# EAGLE design Taiwan_Arduino (EAGLE 7.2.0)
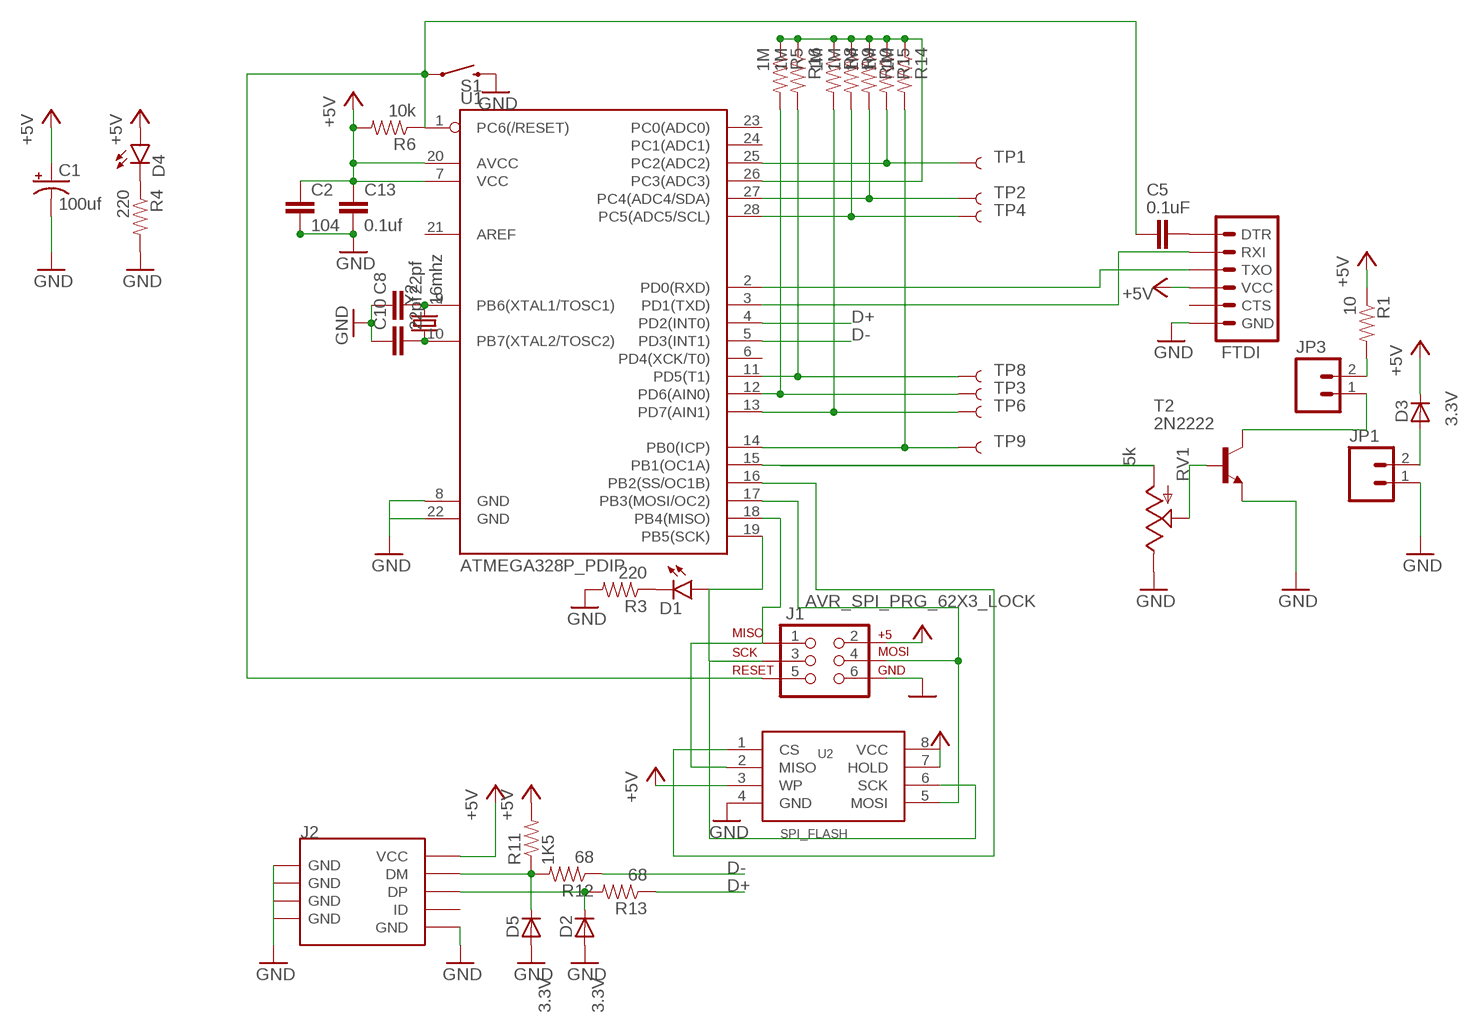
[diagram p0: schematic, sheet 1]

## Parts
C1  100uf  CPOL-USE2.5-5  [E2,5-5]
C2  104  CAPPTH1  [CAP-PTH-5MM]
C5  0.1uF  CAPPTH1  [CAP-PTH-5MM]
C8  22pf  CAPPTH1  [CAP-PTH-5MM]
C10  22pf  CAPPTH1  [CAP-PTH-5MM]
C13  0.1uf  CAPPTH1  [CAP-PTH-5MM]
D1  LED3MM  [LED3MM]
D2  3.3V  DIODE-VERTDIODE_SM_VERT  [0204V]
D3  3.3V  DIODE-VERTDIODE_SM_VERT  [0204V]
D4  LED3MM  [LED3MM]
D5  3.3V  DIODE-VERTDIODE_SM_VERT  [0204V]
FTDI  ARDUINO_SERIAL_PROGRAMLOCK  [1X06_LOCK]
J1  AVR_SPI_PRG_62X3_LOCK  [2X3_LOCK]
J2  USB-MINIUSB-5P-TH  [MINI-5P]
JP1  Battery  M02PTH  [1X02]
JP3  M021X02_NO_SILK  [1X02_NO_SILK]
R1  10  RESISTORPTH-1/4W-VERT  [AXIAL-0.1]
R3  220  RESISTORPTH-1/4W-VERT  [AXIAL-0.1]
R4  220  RESISTORPTH-1/4W-VERT  [AXIAL-0.1]
R5  1M  RESISTORPTH-1/4W-VERT  [AXIAL-0.1]
R6  10k  RESISTORPTH-1/4W-VERT  [AXIAL-0.1]
R8  1M  RESISTORPTH-1/4W-VERT  [AXIAL-0.1]
R9  1M  RESISTORPTH-1/4W-VERT  [AXIAL-0.1]
R10  1M  RESISTORPTH-1/4W-VERT  [AXIAL-0.1]
R11  1K5  RESISTORPTH-1/4W-VERT  [AXIAL-0.1]
R12  68  RESISTORPTH-1/4W-VERT  [AXIAL-0.1]
R13  68  RESISTORPTH-1/4W-VERT  [AXIAL-0.1]
R14  1M  RESISTORPTH-1/4W  [AXIAL-0.4]
R15  1M  RESISTORPTH-1/4W-VERT  [AXIAL-0.1]
R16  1M  RESISTORPTH-1/4W-VERT  [AXIAL-0.1]
RV1  5k  POT  [ALPS_POT]
S1  SWITCH-MOMENTARY-2PTH  [TACTILE-PTH]
T2  2N2222  [TO92-EBC-OVAL]
TP1  TEST-POINT  [PADBIG]
TP2  TEST-POINT  [PADBIG]
TP3  TEST-POINT  [PADBIG]
TP4  TEST-POINT  [PADBIG]
TP6  TEST-POINT  [PADBIG]
TP8  TEST-POINT  [PADBIG]
TP9  TEST-POINT  [PADBIG]
U1  ATMEGA328P_PDIP  [DIL28-3]
U2  SPI_FLASH  SPI_FLASH-X25XX  [DIL08]
Y2  16mhz  CRYSTALHC49UV  [HC49U-V]

## Nets
1: R8.P$2 TP6.P$1 U1.13(PD7(AIN1))
+5V: C1.+ C2.1 C13.1 D3.2(C) D4.A FTDI.4(VCC) J1.2 J2.VCC R1.P$1 R6.P$2 R11.P$2 U1.7(VCC) U1.20(AVCC) U2.3(WP) U2.7(HOLD) U2.8(VCC)
D+: R13.P$1 U1.4(PD2(INT0))
D-: R12.P$1 U1.5(PD3(INT1))
GND: C1.- C2.2 C8.1 C10.1 C13.2 D2.1(A) D5.1(A) FTDI.6(GND) J1.6 J2.GND J2.S1(GND) J2.S2(GND) J2.S3(GND) J2.S4(GND) JP1.1 R3.P$2 R4.P$2 RV1.P$1(E) S1.3 T2.E U1.8(GND) U1.22(GND) U2.4(GND)
N$1: JP3.2 R1.P$2
N$2: RV1.P$3(A) U1.15(PB1(OC1A))
N$3: R14.P$2 TP9.P$1 U1.14(PB0(ICP))
N$4: C8.2 U1.9(PB6(XTAL1/TOSC1)) Y2.2
N$5: R15.P$2 TP1.P$1 U1.25(PC2(ADC2))
N$6: D1.A J1.3 U1.19(PB5(SCK)) U2.6(SCK)
N$7: R10.P$2 TP2.P$1 U1.27(PC4(ADC4/SDA))
N$8: R9.P$2 TP4.P$1 U1.28(PC5(ADC5/SCL))
N$9: FTDI.3(TXO) U1.2(PD0(RXD))
N$10: J1.1 U1.18(PB4(MISO)) U2.2(MISO)
N$11: R5.P$1 R8.P$1 R9.P$1 R10.P$1 R14.P$1 R15.P$1 R16.P$1 U1.26(PC3(ADC3))
N$12: JP3.1 T2.C
N$13: C10.2 U1.10(PB7(XTAL2/TOSC2)) Y2.1
N$14: FTDI.2(RXI) U1.3(PD1(TXD))
N$15: D5.2(C) J2.DM R11.P$1 R12.P$2
N$16: D2.2(C) J2.DP R13.P$2
N$17: R16.P$2 TP8.P$1 U1.11(PD5(T1))
N$18: D3.1(A) JP1.2
N$20: D1.K(C) R3.P$1
N$22: RV1.P$2(S) T2.B
N$23: J1.4 U1.17(PB3(MOSI/OC2)) U2.5(MOSI)
N$25: D4.K(C) R4.P$1
N$26: C5.2 FTDI.1(DTR)
N$28: U1.16(PB2(SS/OC1B)) U2.1(CS)
N$29: R5.P$2 TP3.P$1 U1.12(PD6(AIN0))
RST: C5.1 J1.5 R6.P$1 S1.1 U1.1(PC6(/RESET))
Unconnected: FTDI.5(CTS) J2.ID U1.6(PD4(XCK/T0)) U1.21(AREF) U1.23(PC0(ADC0)) U1.24(PC1(ADC1))

## Library data of the parts
C1 = adafruit:CPOL-US: POLARIZED CAPACITOR, American symbol
C2 C5 C8 C10 C13 = SparkFun-Capacitors:CAP: Capacitor Standard 0603 ceramic capacitor, and 0.1" leaded capacitor.
D1 D4 = SparkFun-LED:LED: LEDs Standard schematic elements and footprints for 5mm, 3mm, 1206, and 0603 sized LEDs. 5mm - Spark Fun Electronics SKU : COM-00529 (and others)
D2 D3 D5 = _JJG-parts:DIODE-VERT: DIODE vertical general purpose 1A diode,
FTDI = SparkFun-Connectors:ARDUINO_SERIAL_PROGRAM: FTDI connector footprints
J1 = SparkFun-Connectors:AVR_SPI_PRG_6: AVR ISP 6 Pin This is the reduced ISP connector for AVR programming. Common on Arduino. This footprint will take up less PCB space and can be used with a 10-pin to 6-pin adapter such as SKU: BOB-08508 **Special note about "TEST_POINT" package. The stop mask is on the top side, so if you want your programming test points to be on the bottom of your board, make sure to place this package on the bottom side of the board. This also ensure that the orientation to program from the bottom side will be correct.
J2 = Connector :USB-MINIUSB-5P
JP1 JP3 = SparkFun-Connectors:M02: Standard 2-pin 0.1" header. Use with - straight break away headers ( PRT-00116) - right angle break away headers (PRT-00553) - swiss pins (PRT-00743) - machine pins (PRT-00117) - female headers (PRT-00115) Molex polarized connector foot print use with: PRT-08233 with associated crimp pins and housings. 2.54_SCREWTERM for use with PRT-10571. 3.5mm Screw Terminal footprints for PRT-08084 5mm Screw Terminal footprints for use with PRT-08432
R1 R3-R6 R8-R16 = SparkFun-Resistors:RESISTOR: Resistor Basic schematic elements and footprints for 0603, 1206, and PTH resistors.
RV1 = SparkFun-Electromechanical:POT; PROD_ID: RES-09177
S1 = SparkFun-Electromechanical:SWITCH-MOMENTARY-2: Various NO switches- pushbuttons, reed, etc
T2 = adafruit:2N2222: NPN TRANSISTOR Big oval pads
TP1-TP4 TP6 TP8 TP9 = SparkFun-Passives:TEST-POINT: Bare copper test points for troubleshooting or ICT
U1 = SparkFun-DigitalIC:ATMEGA328P_PDIP: uC used in the Arduino 32kb flash, 1k EEPROM, 2k SRAM This is the through-hole version of this chip.
U2 = SparkFun-DigitalIC:SPI_FLASH-X25XX: 8pin SPI Flash series x25xx. Works with devices like W25X32 and BR25L32
Y2 = SparkFun-FreqCtrl:CRYSTAL: Various standard crystals. Proven footprints.

## Net classes
0 default: width 0.254 mm

## Board
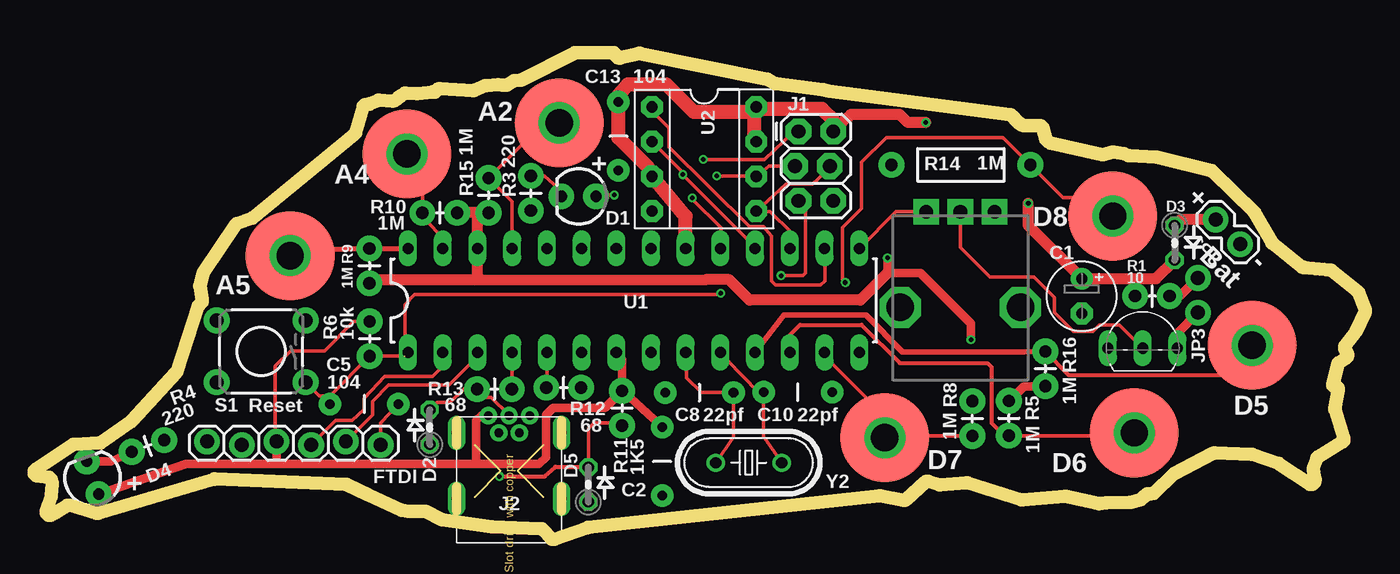
[diagram p1: board, top side]
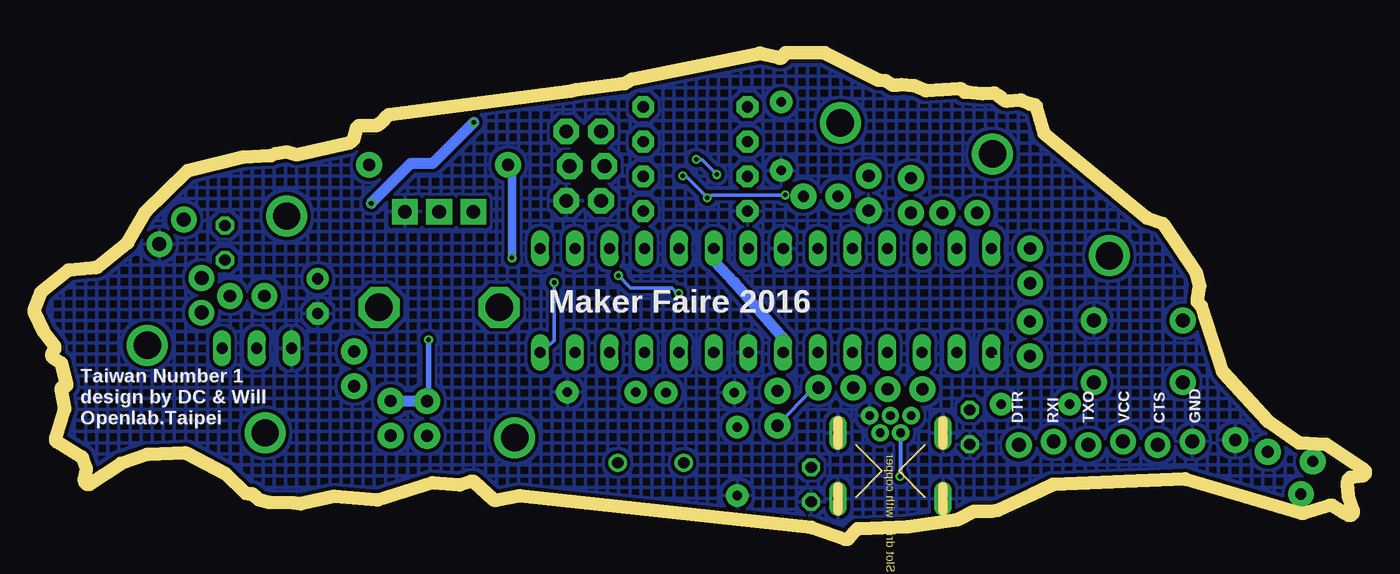
[diagram p2: board, bottom side, seen from below]

Size 97.41 x 35.64 mm. Coordinates in mm from the lower left corner, seen from the top.
Outline: 23.85,31.22 arc-53 24.45,32.02
Outline: 1.62,1.99 2.39,2.47 arc-48 2.59,2.49 4.55,1.92 arc33 4.7,1.92 13.13,4.41 arc-19 13.21,4.42 22.81,4.02 arc-24 22.91,4 24.44,3.26 26.87,2.13 arc16 26.94,2.11 27.35,2.05 28.53,2.08 arc-28 28.65,2.05 29.79,1.47 arc19 29.87,1.45 33.47,0.93 arc6 33.5,0.93 37.05,0.79 arc-45 37.23,0.71 37.82,0.08 arc67 38.09,0.01 40.5,0.87 arc-13 40.56,0.88 61.84,3.19 arc-16 61.91,3.19 63.61,2.88 arc53 63.83,2.94 65.19,4.19 arc-60 65.44,4.24 66.23,4 arc22 66.33,3.99 68.2,4.15 arc-22 68.3,4.14 72.24,2.92 arc22 72.33,2.91 75.41,3.17 arc-17 75.49,3.16 77.85,2.65 arc-29 77.9,2.63 78.44,2.69 arc-7 78.47,2.69 80.19,2.71 arc15 80.25,2.72 80.93,2.91 arc34 81.05,2.99 81.11,3.06 arc-11 81.15,3.09 81.46,3.34 arc85 81.55,3.29 81.88,3.38 arc30 82,3.44 83.33,4.74 arc-17 83.39,4.79 86.26,6.29 arc-29 86.39,6.32 89.06,6.24 arc-17 89.14,6.23 91.03,5.57 arc-15 91.09,5.55 93.3,4.07 arc109 93.69,4.22 93.72,4.32 arc26 93.72,4.44 93.6,5.09 arc-31 93.61,5.22 93.86,5.93 arc-39 93.97,6.06 95.72,7.13 arc76 95.83,7.42 95.19,9.49 arc-27 95.18,9.61 95.42,10.94 arc111 95.12,11.24 arc-115 95.02,11.35 95.37,12.78 arc-42 95.48,12.93 96,13.29 arc82 96.08,13.61 95.93,13.92 arc-64 95.95,14.19 96.7,15.17 97.38,16.64 arc46 97.39,16.84 96.92,18.04 arc30 96.84,18.15 94.98,19.66 arc33 94.84,19.72 92.87,19.92 arc-33 92.74,19.98 90.61,21.68 arc-22 90.55,21.76 89.32,23.9 arc16 89.28,23.96 86.25,26.93 arc31 86.14,27 82.16,27.99 arc11 82.11,27.99 80.15,28.1 arc-19 80.07,28.11 79.73,28.25 79.01,28.37 arc25 78.9,28.36 78.24,28.18 arc-28 78.12,28.18 74.4,29.01 arc-22 74.31,29.05 74.13,29.18 arc-39 74.03,29.31 73.81,30.1 arc73 73.57,30.28 72.4,30.31 arc-34 72.26,30.36 71.97,30.56 71.53,31.02 arc39 71.38,31.1 58.16,32.83 57.86,32.89 57.74,32.91 57.68,32.92 54.3,33.35 arc-21 54.21,33.38 53.65,33.68 arc17 53.58,33.71 44.34,35.58 arc25 44.23,35.58 42.88,35.25 arc-87 42.57,35.43 42.57,35.45 arc74 42.32,35.64 39.65,35.64 arc27 39.53,35.61 35.64,33.64 arc-24 35.54,33.61 35.1,33.58 34.66,33.3 arc-34 34.51,33.26 34.25,33.27 33.93,33.29 33.07,33.22 arc18 33,33.2 32.22,32.89 arc-25 32.11,32.87 29.71,33 arc51 29.5,32.92 29.34,32.74 29.25,32.76 arc17 29.18,32.76 28.02,32.64 27.23,32.68 arc35 27.08,32.64 26.85,32.49 26.6,32.29 arc-2 26.6,32.28 26.39,32.12 arc-59 26.39,32.12 26.22,32.1 25.23,32.15 arc27 25.12,32.13 24.57,31.89 arc-12 24.53,31.88 24.25,31.82 arc62 24.06,31.64 23.51,29.78 arc-34 23.43,29.65 16.01,23.56 arc-20 15.94,23.52 14.87,23.14 arc36 14.74,23.04 12.41,19.57 arc19 12.38,19.5 12.14,18.61 arc26 12.13,18.5 12.31,17.56 arc-55 12.24,17.34 12.07,17.17 arc26 12.01,17.07 10.45,12.33 arc-24 10.4,12.24 7.15,8.69 arc-13 7.11,8.65 4.9,7.1 arc-32 4.76,7.05 2.94,6.97 arc31 2.81,6.92 0.11,5.12 arc138 0.22,4.66 1.03,4.55 arc-62 1.23,4.38 1.32,4.14 arc-27 1.34,4.02 1.26,3.22 arc-12 1.24,3.17 0.89,2.1 arc135 1.25,1.8 1.62,1.99
Copper layers (1*16): Top 0.035mm / dielectric 1.5mm / Bottom 0.035mm
Design rules "SeeedStudio_2layer_DRU_no_angle_20140221": minimum track width 6mil, minimum drill 12mil, track to track 6mil, track to pad 6mil, pad to pad 6mil, via to via 6mil, smd to smd 0mil, copper to edge 10mil, drill to drill 10mil, minimum pad ring 10mil, minimum via ring 6mil, stop-mask expansion 2mil, vias tented up to drill 100mil, thermal gap 10mil

### Footprints (pad centres in the part's own frame; a part is rotated, then mirrored left to right if it is on the bottom)
E2,5-5 = drill 0.813 pad 1.6: + -1.27,0 | drill 0.813 pad 1.6 octagon: - 1.27,0
CAP-PTH-5MM = drill 0.7 pad 1.651: 1 -2.5,0; 2 2.5,0
LED3MM = drill 0.813 pad 1.88: A -1.27,0; K 1.27,0
0204V = drill 0.813 octagon: 1 -1.27,0; 2 1.27,0
1X06_LOCK = drill 1.016 pad 1.88: 1 0,0; 2 2.54,-0.254; 3 5.08,0; 4 7.62,-0.254; 5 10.16,0; 6 12.7,-0.254
2X3_LOCK = drill 1.016 pad 1.88 octagon: 1 0,0; 2 0,2.54; 3 2.54,-0.254; 4 2.54,2.286; 5 5.08,0; 6 5.08,2.54
MINI-5P = drill 0.635 pad 1.27: DM -1.016,0.75; DP 0.254,0; GND 0.254,-1.524; ID -1.016,-0.75; VCC 0.254,1.524 | drill 0.7 pad 1.27 long: S1 -5.842,3.85; S2 -1.016,3.85; S3 -5.842,-3.85; S4 -1.016,-3.85
1X02 = drill 1.016 pad 1.88: 1 0,0; 2 2.54,0
1X02_NO_SILK = drill 1.016 pad 1.88: 1 0,0; 2 2.54,0
AXIAL-0.1 = drill 0.9 pad 1.88: P$1 0,0; P$2 2.54,0
AXIAL-0.4 = drill 0.9 pad 1.88: P$1 -5.08,0; P$2 5.08,0
ALPS_POT = drill 1 pad 1.88 square: P$1 7,-2.5; P$2 7,0; P$3 7,2.5 | drill 2 octagon: P$4 0,-4.4; P$5 0,4.4
TACTILE-PTH = drill 1.016 pad 1.88: 1 -3.251,2.261; 2 3.251,2.261; 3 -3.251,-2.261; 4 3.251,-2.261
TO92-EBC-OVAL = drill 0.813 long: B 0,-1.27; C 2.54,-1.27; E -2.54,-1.27
PADBIG = smd 6.5 x 6.5: P$1 0,0 | drill 2: P$2 0,0
DIL28-3 = drill 0.813 long: 1 -16.51,-3.81; 2 -13.97,-3.81; 3 -11.43,-3.81; 4 -8.89,-3.81; 5 -6.35,-3.81; 6 -3.81,-3.81; 7 -1.27,-3.81; 8 1.27,-3.81; 9 3.81,-3.81; 10 6.35,-3.81; 11 8.89,-3.81; 12 11.43,-3.81; 13 13.97,-3.81; 14 16.51,-3.81; 15 16.51,3.81; 16 13.97,3.81; 17 11.43,3.81; 18 8.89,3.81; 19 6.35,3.81; 20 3.81,3.81; 21 1.27,3.81; 22 -1.27,3.81; 23 -3.81,3.81; 24 -6.35,3.81; 25 -8.89,3.81; 26 -11.43,3.81; 27 -13.97,3.81; 28 -16.51,3.81
DIL08 = drill 0.813 pad 1.6 octagon: 1 -3.81,-3.81; 2 -1.27,-3.81; 3 1.27,-3.81; 4 3.81,-3.81; 5 3.81,3.81; 6 1.27,3.81; 7 -1.27,3.81; 8 -3.81,3.81
HC49U-V = drill 0.813: 1 -2.413,0; 2 2.413,0

### Placement (x,y rotation side)
C1  76.65,17.82 270 top
C2  45.95,5.72 270 top
C5  24.15,9.92 0 top
C8  48.67,10.75 0 top
C10  55.88,10.79 180 top
C13  42.75,29.52 270 top
D1  39.85,25.12 180 top
D2  28.95,8.22 90 top
D3  83.45,21.72 270 top
D4  4.28,4.51 110 top
D5  40.55,4.02 90 top
FTDI  25.35,6.92 180 top
J1  55.93,29.87 270 top
J2  34.75,8.82 90 top
JP1  88.25,21.62 135 top
JP3  85.16,16.6 90 top
R1  80.55,17.82 0 top
R3  36.35,26.62 270 top
R4  7.13,6.41 20 top
R5  71.33,10.14 270 top
R6  24.55,13.42 90 top
R8  68.65,10.12 270 top
R9  24.53,18.76 90 top
R10  30.95,23.92 180 top
R11  43.02,8.34 90 top
R12  37.47,11.1 0 top
R13  34.95,11.01 180 top
R14  67.81,27.42 0 top
R15  33.25,23.92 90 top
R16  73.99,11.22 90 top
RV1  67.78,16.99 90 top
S1  16.61,13.77 180 top
T2  81.11,15.27 0 top
TP1  38.42,30.49 290 top
TP2  27.28,28.22 290 top
TP3  80.5,7.8 290 top
TP4  18.73,20.78 290 top
TP6  62.25,7.44 290 top
TP8  89.13,14.22 200 top
TP9  78.93,23.68 200 top
U1  43.87,17.5 0 top
U2  49.03,27.85 270 top
Y2  52.29,5.62 180 top

### Tracks (layer width: path | path; a pad name or v marks a point on that pad's centre or on a via)
1
  Top 0.254: U1.13 58.05,13.48 58.05,13.22 62.45,8.82 62.35,7.82 62.45,7.72 63.26,7.72 63.75,8.22 63.75,7.82 63.45,7.52 TP6.P$1 62.88,7.58 R8.P$2
+5V  (via drill 0.33)
  Top 0.254: 17.85,7.29 FTDI.4 17.65,7.25 17.65,12.72 18.75,13.82 21.25,13.82 23.39,15.96 R6.P$2
  Top 0.305: J2.VCC 32.75,9.07 32.73,9.09
  Top 0.61: 17.75,5.52 17.73,5.6 17.73,5.64 | 17.75,5.52 11.11,5.52 D4.A | FTDI.4 17.73,5.64 | 17.73,5.64 17.75,5.52 | 17.75,5.52 32.35,5.52 32.35,5.82 | 32.35,5.82 32.35,8.72 32.73,9.09 | 32.35,5.82 32.45,5.52 36.95,5.52 37.45,6.02 37.45,9.12 37.95,9.62 41.76,9.62 R11.P$2 | R11.P$2 43.19,10.78 45.75,8.42 C2.1 | R11.P$2 43.02,13.17 U1.7 | R1.P$1 80.55,19.09
  Top 0.813: 17.7,7.17 FTDI.4 | U2.3 45.22,26.55 | v65.25,30.52 63.95,30.52 63.35,31.12 59.75,31.12 59.55,30.92 59.12,30.52 J1.2 | v72.75,24.62 72.75,22.99 C1.+ 80.55,19.09 80.95,19.09 82.09,19.09 D3.2
  Top 1.016: U1.20 47.68,23.65 U2.3 | 52.69,31.32 48.25,31.32 46.25,33.32 43.45,33.32 42.75,32.52 C13.1 42.75,29.42 44.95,27.22 44.95,26.85 U2.3 | 52.69,31.32 U2.8 52.89,31.52 57.65,31.52 58.47,30.69 J1.2 | 52.69,31.32 52.69,29.07 U2.7 | U2.3 45.18,26.58
  Bottom 0.813: U1.7 42.6,14.76 46.15,18.82 47.65,20.44 U1.20 | v65.25,30.52 68.25,27.52 69.85,27.52 v72.75,24.62
D+
  Top 0.254: U1.4 34.98,11.04 R13.P$1
D-
  Top 0.254: U1.5 37.52,11.05 R12.P$1
GND
  pour Bottom (isolate 0.254, hatched): -1.15,40.52 103.75,40.52 103.75,-6.18 -1.15,-6.18
N$1
  Top 0.61: R1.P$2 83.83,17.82 JP3.2
N$2
  Top 0.254: U1.15 63.06,23.99 RV1.P$3
N$3  (via drill 0.36)
  Top 0.254: v59.35,18.82 59.15,19.02 59.15,22.82 60.55,24.22 60.55,27.62 62.35,29.42 70.89,29.42 R14.P$2 75.29,25.02 75.95,25.02
  Top 0.305: 75.95,25.02 78.55,25.02 78.65,25.12 78.19,25.12 TP9.P$1
  Bottom 0.254: v59.35,18.82 59.35,14.52 U1.14
N$4
  Top 0.254: U1.9 47.75,13.42 47.75,11.82 48.82,10.75 C8.2 51.17,7.51 Y2.2
N$5
  Top 0.254: U1.25 34.98,24.73 R15.P$2 37.29,30.49 TP1.P$1
N$6  (via drill 0.33)
  Top 0.254: J1.3 53.79,27.33 U2.6 50.18,26.58 v49.95,26.62 | v48.15,25.02 48.15,24.92 50.25,22.84 U1.19 | D1.A 40.95,25.12 41.05,25.22 v42.45,25.22
  Bottom 0.254: v49.95,26.62 49.65,26.52 v48.15,25.02 48.05,25.02 47.85,25.22 v42.45,25.22
N$7
  Top 0.254: U1.27 29.85,21.26 29.85,22.12 28.71,23.36 R10.P$2 28.41,26.46 28.35,26.72 28.41,27.69 TP2.P$1
N$8
  Top 0.254: U1.28 24.62,21.21 R9.P$2
  Top 0.406: TP4.P$1 17.97,21.21 U1.28
N$9
  Top 0.254: U1.2 29.9,12.66 29.15,11.92 25.65,11.92 24.15,10.32 24.15,9.52 23.25,8.72 22.07,8.72 FTDI.3
N$10  (via drill 0.33)
  Top 0.254: J1.1 55.61,29.87 53.45,27.82 v48.95,27.82 | v47.45,26.72 47.45,26.69 | v47.45,26.72 47.45,26.89 U2.2 | U1.18 52.76,21.41 v47.45,26.72
  Bottom 0.254: v48.95,27.82 48.55,27.82 v47.45,26.72
N$11  (via drill 0.33, 0.36 pad 0.41)
  Top 0.61: R16.P$1 72.41,11.22 R5.P$1 | v68.55,14.62 68.55,15.82 64.85,19.52 62.45,19.52 v62.45,20.62
  Top 0.813: 32.24,19 49.16,19.02 50.85,19.02 52.35,17.52 60.45,17.52 62.45,19.52 | 32.24,19 32.45,19.1 | 32.45,19.1 32.77,19 32.24,19 | 24.55,18.92 24.77,18.72 R9.P$1 24.78,19 32.24,19 | 32.58,19.03 32.45,19.1 | 32.45,19.1 32.45,20.8 U1.26 32.44,23.9 32.45,23.92 | 32.45,23.92 R10.P$1 | 32.45,23.92 R15.P$1
  Bottom 0.406: R8.P$1 68.55,10.12 v68.55,14.62
  Bottom 0.61: R14.P$1 62.45,27.14 v62.45,20.62
  Bottom 0.813: R5.P$1 68.68,10.14 R8.P$1
N$12
  Top 0.61: T2.C 83.66,15.1 JP3.1
N$13
  Top 0.254: U1.10 50.59,13.12 50.75,13.12 52.98,10.79 C10.2 53.38,7.54 Y2.1
N$14
  Top 0.254: U1.3 32.44,13.4 30.35,11.32 25.95,11.32 24.75,10.12 24.75,9.11 FTDI.2
N$15  (via drill 0.33)
  Top 0.254: D5.2 40.55,8.12 40.95,8.52 42.54,8.52 R11.P$1
  Top 0.305: v34.05,4.62 37.35,4.62 38.15,5.32 40.48,5.32 D5.2
  Bottom 0.254: R12.P$2 40.45,11 R11.P$1
  Bottom 0.305: J2.DM 34,4.77 v34.05,4.62
N$16
  Top 0.254: J2.DP 34.75,9.12 33.45,10.42 33.01,10.42 R13.P$2 31.45,11.01 30.45,10.02 29.48,10.02 D2.2
N$17
  Top 0.254: TP8.P$1 89.35,14.12
  Top 0.305: R16.P$2 75.73,12.02 89.65,12.02 89.25,13.64 TP8.P$1
  Top 0.406: U1.11 54.85,16.42 60.85,16.42 63.55,13.72 72.43,13.72 R16.P$2
N$18
  Top 0.813: JP1.2 83.88,23.41 D3.1
N$20
  Top 0.254: D1.K 38.58,25.49 37.35,26.62 R3.P$1
N$22
  Top 0.254: RV1.P$2 67.78,21.39 69.95,19.22 73.15,19.22 74.65,17.72 74.65,16.62 76.05,15.22 77.45,15.22 77.95,15.72 79.4,15.72 T2.B
N$23
  Top 0.254: U1.17 55.4,21.01 55.4,22.47 53.85,24.02 52.86,24.02 U2.5 55.01,26.02 56.95,26.02 58.22,27.18 J1.4
N$25
  Top 0.61: D4.K 5.63,5.71 R4.P$1
N$26
  Top 0.254: FTDI.1 25.35,8.52 C5.2
N$28
  Top 0.254: U2.1 45.22,31.35 46.45,30.12 46.45,28.72 52.35,22.92 53.35,22.92 53.95,22.22 53.95,18.92 54.25,18.62 57.55,18.62 57.85,18.92 57.85,21.1 U1.16
N$29
  Top 0.254: 80.51,7.59 70.97,7.59 70.65,7.92 71.02,7.92 R5.P$2
  Top 0.305: U1.12 55.3,14.96 56.05,15.72 60.55,15.72 63.35,12.92 69.75,12.92 70.05,12.62 70.05,8.52 70.65,7.92
  Top 0.406: 80.51,7.59 TP3.P$1
RST  (via drill 0.33)  (1 unrouted)
  Top 0.254: v50.25,18.02 50.15,18.02 50.15,17.92 27.85,17.92 27.15,17.22 27.15,13.42 | v54.65,19.32 56.25,19.32 56.45,19.52 56.45,24.27 J1.5 | C5.1 21.65,10.52 | 21.65,10.52 R6.P$1 27.09,13.42 U1.1 27.36,13.49 27.29,13.42 | 21.65,10.52 20.85,10.52 S1.1
  Bottom 0.254: v50.25,18.02 50.35,18.02 50.75,18.42 53.75,18.42 v54.65,19.32

### Text on the board
tPlace: 104 | A2 | A4 | + | + | D8 | Bat | - | A5 | Reset | 104 | D5 | 22pf | 22pf | D6 | D7 | +
bPlace: Maker Faire 2016 | DTR / / RXI / / TXO / / VCC / / CTS / / GND | Taiwan Number 1 / design by DC & Will / Openlab.Taipei